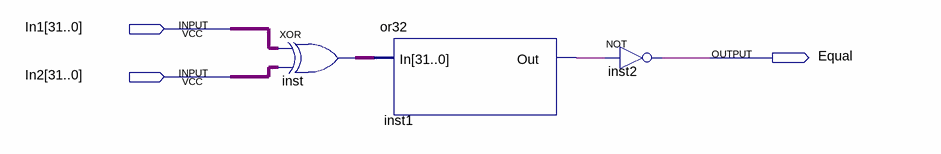
[diagram p0: schematic sheet]
// Quartus schematic Equal.bdf as structural Verilog: 3 symbols, 3 pins
module Equal (
  input  [31:0] In1,
  input  [31:0] In2,
  output Equal
);

  wire inst1_out;
  wire [31:0] inst_out;

  assign inst_out = In1 ^ In2;  // XOR inst, 32 bits wide
  or32 inst1 (.In(inst_out), .Out(inst1_out));
  not inst2 (Equal, inst1_out);
endmodule
